# Altium schematic sheet [6]-MIPI-CSI_GPIOs and I2C.SchDoc: RK3399 SOM Board Design V1.0
size A4; Author: AVIRAL MISHRA; DocumentNumber: 8; SheetNumber: 8; SheetTotal: 21; PROJECT CODE: A_V1.0
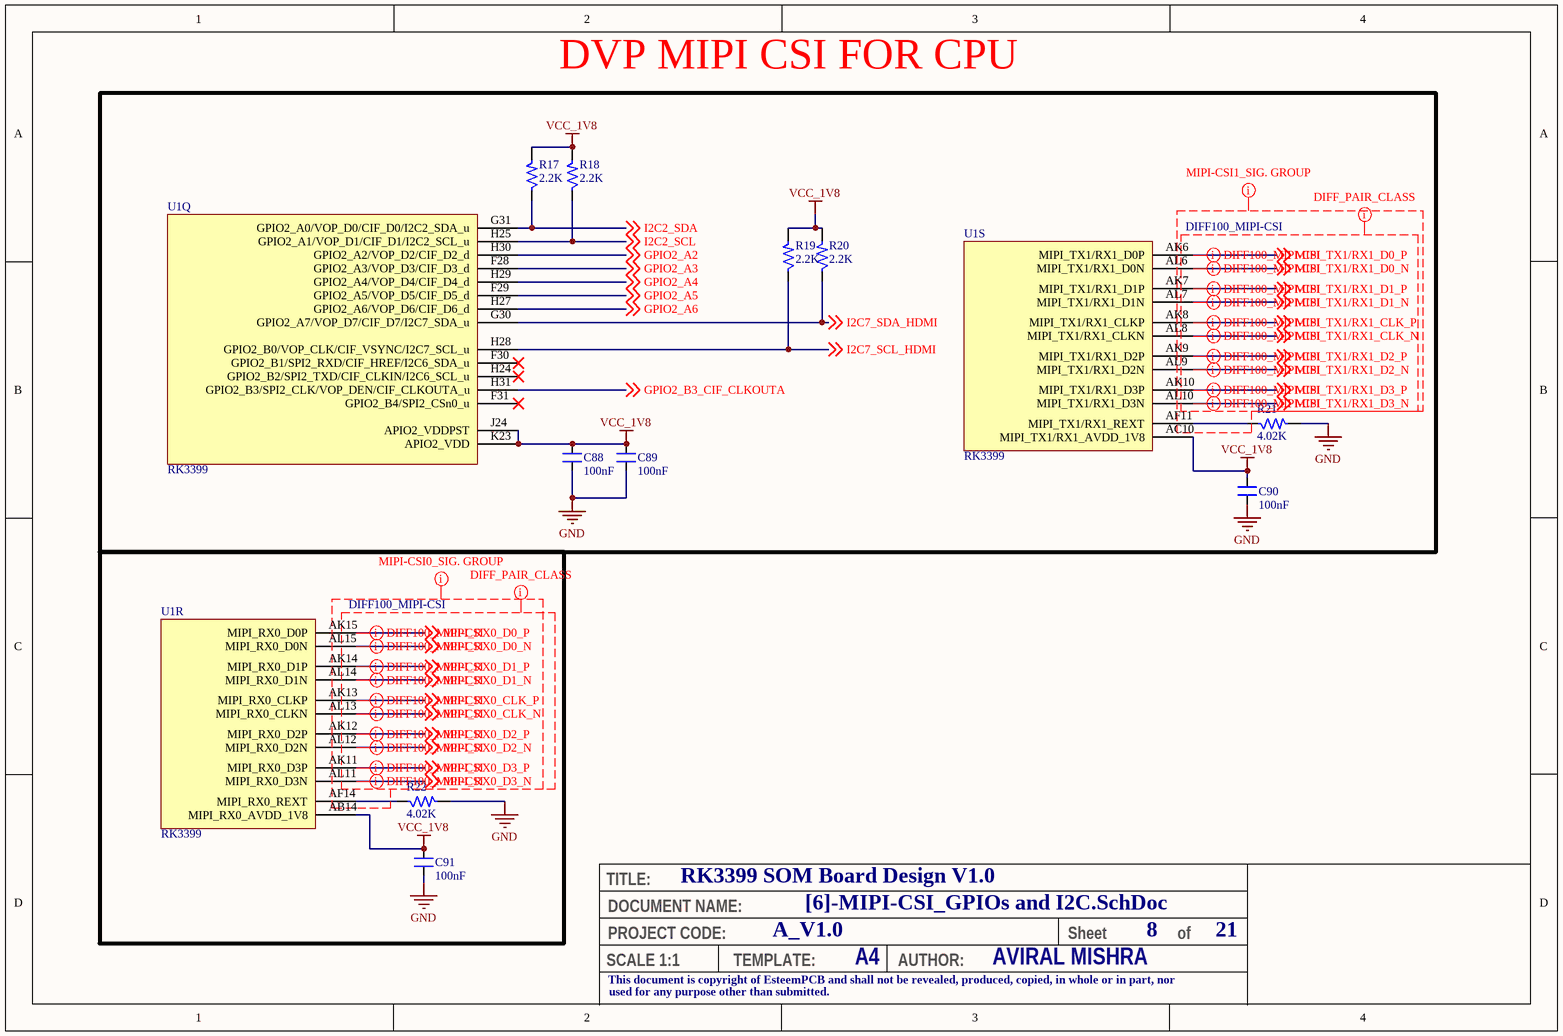
[diagram p0: [6]-MIPI-CSI_GPIOs and I2C.SchDoc]

## Parts
C88  100nF  [CAP_0201]
C89  100nF  [CAP_0201]
C90  100nF  [CAP_0201]
C91  100nF  [CAP_0201]
R17  2.2K  [RES_0201]
R18  2.2K  [RES_0201]
R19  2.2K  [RES_0201]
R20  2.2K  [RES_0201]
R21  4.02K  [RES_0201]
R22  4.02K  [RES_0201]
U1  RK3399  [FBGA828_23_826X826]  (parts Q,R,S of 24)

## Blocks framed on the sheet
DVP MIPI CSI FOR CPU: C88-C90 R17-R21 U1

## Nets
GND: C88.1 C89.1 C90.1 C91.1 R21.2 R22.2
VCC_1V8: C88.2 C89.2 C90.2 C91.2 R17.2 R18.2 R19.2 R20.2 U1.AB14(MIPI_RX0_AVDD_1V8) U1.AC10(MIPI_TX1/RX1_AVDD_1V8) U1.J24(APIO2_VDDPST) U1.K23(APIO2_VDD)
GPIO2_A2: U1.H30(GPIO2_A2/VOP_D2/CIF_D2_d) ; off-sheet GPIO2_A2
GPIO2_A3: U1.F28(GPIO2_A3/VOP_D3/CIF_D3_d) ; off-sheet GPIO2_A3
GPIO2_A4: U1.H29(GPIO2_A4/VOP_D4/CIF_D4_d) ; off-sheet GPIO2_A4
GPIO2_A5: U1.F29(GPIO2_A5/VOP_D5/CIF_D5_d) ; off-sheet GPIO2_A5
GPIO2_A6: U1.H27(GPIO2_A6/VOP_D6/CIF_D6_d) ; off-sheet GPIO2_A6
GPIO2_B3_CIF_CLKOUTA: U1.H31(GPIO2_B3/SPI2_CLK/VOP_DEN/CIF_CLKOUTA_u) ; off-sheet GPIO2_B3_CIF_CLKOUTA
I2C2_SCL: R18.1 U1.H25(GPIO2_A1/VOP_D1/CIF_D1/I2C2_SCL_u) ; off-sheet I2C2_SCL
I2C2_SDA: R17.1 U1.G31(GPIO2_A0/VOP_D0/CIF_D0/I2C2_SDA_u) ; off-sheet I2C2_SDA
I2C7_SCL_HDMI: R19.1 U1.H28(GPIO2_B0/VOP_CLK/CIF_VSYNC/I2C7_SCL_u) ; off-sheet I2C7_SCL_HDMI
I2C7_SDA_HDMI: R20.1 U1.G30(GPIO2_A7/VOP_D7/CIF_D7/I2C7_SDA_u) ; off-sheet I2C7_SDA_HDMI
MIPI_RX0_CLK_N: U1.AL13(MIPI_RX0_CLKN) ; off-sheet MIPI_RX0_CLK_N
MIPI_RX0_CLK_P: U1.AK13(MIPI_RX0_CLKP) ; off-sheet MIPI_RX0_CLK_P
MIPI_RX0_D0_N: U1.AL15(MIPI_RX0_D0N) ; off-sheet MIPI_RX0_D0_N
MIPI_RX0_D0_P: U1.AK15(MIPI_RX0_D0P) ; off-sheet MIPI_RX0_D0_P
MIPI_RX0_D1_N: U1.AL14(MIPI_RX0_D1N) ; off-sheet MIPI_RX0_D1_N
MIPI_RX0_D1_P: U1.AK14(MIPI_RX0_D1P) ; off-sheet MIPI_RX0_D1_P
MIPI_RX0_D2_N: U1.AL12(MIPI_RX0_D2N) ; off-sheet MIPI_RX0_D2_N
MIPI_RX0_D2_P: U1.AK12(MIPI_RX0_D2P) ; off-sheet MIPI_RX0_D2_P
MIPI_RX0_D3_N: U1.AL11(MIPI_RX0_D3N) ; off-sheet MIPI_RX0_D3_N
MIPI_RX0_D3_P: U1.AK11(MIPI_RX0_D3P) ; off-sheet MIPI_RX0_D3_P
MIPI_TX1/RX1_CLK_N: U1.AL8(MIPI_TX1/RX1_CLKN) ; off-sheet MIPI_TX1/RX1_CLK_N
MIPI_TX1/RX1_CLK_P: U1.AK8(MIPI_TX1/RX1_CLKP) ; off-sheet MIPI_TX1/RX1_CLK_P
MIPI_TX1/RX1_D0_N: U1.AL6(MIPI_TX1/RX1_D0N) ; off-sheet MIPI_TX1/RX1_D0_N
MIPI_TX1/RX1_D0_P: U1.AK6(MIPI_TX1/RX1_D0P) ; off-sheet MIPI_TX1/RX1_D0_P
MIPI_TX1/RX1_D1_N: U1.AL7(MIPI_TX1/RX1_D1N) ; off-sheet MIPI_TX1/RX1_D1_N
MIPI_TX1/RX1_D1_P: U1.AK7(MIPI_TX1/RX1_D1P) ; off-sheet MIPI_TX1/RX1_D1_P
MIPI_TX1/RX1_D2_N: U1.AL9(MIPI_TX1/RX1_D2N) ; off-sheet MIPI_TX1/RX1_D2_N
MIPI_TX1/RX1_D2_P: U1.AK9(MIPI_TX1/RX1_D2P) ; off-sheet MIPI_TX1/RX1_D2_P
MIPI_TX1/RX1_D3_N: U1.AL10(MIPI_TX1/RX1_D3N) ; off-sheet MIPI_TX1/RX1_D3_N
MIPI_TX1/RX1_D3_P: U1.AK10(MIPI_TX1/RX1_D3P) ; off-sheet MIPI_TX1/RX1_D3_P
NetR21_1: R21.1 U1.AF11(MIPI_TX1/RX1_REXT)
NetR22_1: R22.1 U1.AF14(MIPI_RX0_REXT)

Not connected (* = marked no-connect by the designer): U1 F30(GPIO2_B1/SPI2_RXD/CIF_HREF/I2C6_SDA_u)* F31(GPIO2_B4/SPI2_CSn0_u)* H24(GPIO2_B2/SPI2_TXD/CIF_CLKIN/I2C6_SCL_u)*

## Layout directives
net class MIPI-CSI1_SIG. GROUP: MIPI_TX1/RX1_CLK_N, MIPI_TX1/RX1_CLK_P, MIPI_TX1/RX1_D0_N, MIPI_TX1/RX1_D0_P, MIPI_TX1/RX1_D1_N, MIPI_TX1/RX1_D1_P, MIPI_TX1/RX1_D2_N, MIPI_TX1/RX1_D2_P, MIPI_TX1/RX1_D3_N, MIPI_TX1/RX1_D3_P
net class MIPI-CSI0_SIG. GROUP: MIPI_RX0_CLK_N, MIPI_RX0_CLK_P, MIPI_RX0_D0_N, MIPI_RX0_D0_P, MIPI_RX0_D1_N, MIPI_RX0_D1_P, MIPI_RX0_D2_N, MIPI_RX0_D2_P, MIPI_RX0_D3_N, MIPI_RX0_D3_P
differential pair; differential pair class DIFF100_MIPI-CSI: MIPI_RX0_CLK_N, MIPI_RX0_CLK_P, MIPI_RX0_D0_N, MIPI_RX0_D0_P, MIPI_RX0_D1_N, MIPI_RX0_D1_P, MIPI_RX0_D2_N, MIPI_RX0_D2_P, MIPI_RX0_D3_N, MIPI_RX0_D3_P, MIPI_TX1/RX1_CLK_N, MIPI_TX1/RX1_CLK_P, MIPI_TX1/RX1_D0_N, MIPI_TX1/RX1_D0_P, MIPI_TX1/RX1_D1_N, MIPI_TX1/RX1_D1_P, MIPI_TX1/RX1_D2_N, MIPI_TX1/RX1_D2_P, MIPI_TX1/RX1_D3_N, MIPI_TX1/RX1_D3_P
net class DIFF_PAIR_CLASS: MIPI_RX0_CLK_N, MIPI_RX0_CLK_P, MIPI_RX0_D0_N, MIPI_RX0_D0_P, MIPI_RX0_D1_N, MIPI_RX0_D1_P, MIPI_RX0_D2_N, MIPI_RX0_D2_P, MIPI_RX0_D3_N, MIPI_RX0_D3_P, MIPI_TX1/RX1_CLK_N, MIPI_TX1/RX1_CLK_P, MIPI_TX1/RX1_D0_N, MIPI_TX1/RX1_D0_P, MIPI_TX1/RX1_D1_N, MIPI_TX1/RX1_D1_P, MIPI_TX1/RX1_D2_N, MIPI_TX1/RX1_D2_P, MIPI_TX1/RX1_D3_N, MIPI_TX1/RX1_D3_P

## Notes on the sheet
- TITLE:
- DOCUMENT NAME:
- SCALE 1:1
- This document is copyright of EsteemPCB and shall not be revealed, produced, copied, in whole or in part, nor
- PROJECT CODE:
- TEMPLATE:
- A4
- AUTHOR:
- Sheet
- of
- used for any purpose other than submitted.

## Library data of the parts
C88-C91 = CAP_100nF-25V-10%-0201: 0.1µF ±10% 25V Ceramic Capacitor X5R 0201 (0603 Metric) /; Manufacturer: TDK Corporation; Manufacturer Part Number: C0603X5R1E104K030BB; Case/Package: 0201; Supplier-1: Digikey
R17-R20 = RES_2.2K-0.05W-1%-0201: 2.2 kOhms ±1% 0.05W, 1/20W Chip Resistor 0201 (0603 Metric) Thick Film /; Manufacturer: Stackpole Electronics Inc; Manufacturer Part Number: RMCF0201FT2K20; Case/Package: 0201; Supplier-1: Digikey
R21 R22 = RES_4.02K-0.05W-1%-0201: 4.02 kOhms ±1% 0.05W, 1/20W Chip Resistor 0201 (0603 Metric) Thick Film /; Manufacturer: Yageo; Manufacturer Part Number: RC0201FR-074K02L; Case/Package: 0201; Supplier-1: Digikey
U1 = IC_RK3399-FCBGA828: RK3399 is a low power, high performance processor for computing, personal mobile.; Manufacturer: Rockchip; Manufacturer Part Number: RK3399; Case/Package: FCBGA828; Supplier-1: Rockchip